# EAGLE design Fruiting_Chamber (EAGLE 9.5.2)

## Sheet 1 of 4: Power
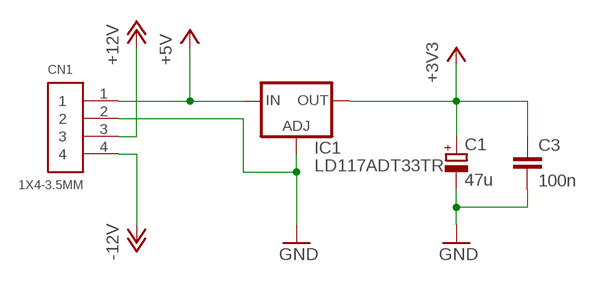
[diagram p0: schematic, sheet 1]

### Parts
C1  47u  CPOL-EUE2.5-6  [E2,5-6]
C3  100n  C-EUC0603  [C0603]
CN1  1X4-3.5MM  [1X04-3.5MM]
IC1  LD117ADT33TR  [DPACK]

### Nets
+3V3: C1.+ C3.1 IC1.4(OUT) ; also sheet 2,3
+5V: CN1.1 IC1.3(IN) ; also sheet 2,3,4
+12V: CN1.3 ; also sheet 2
-12V: CN1.4 ; also sheet 2
GND: C1.- C3.2 CN1.2 IC1.1(ADJ) ; also sheet 2,3,4

## Sheet 2 of 4: Periferals
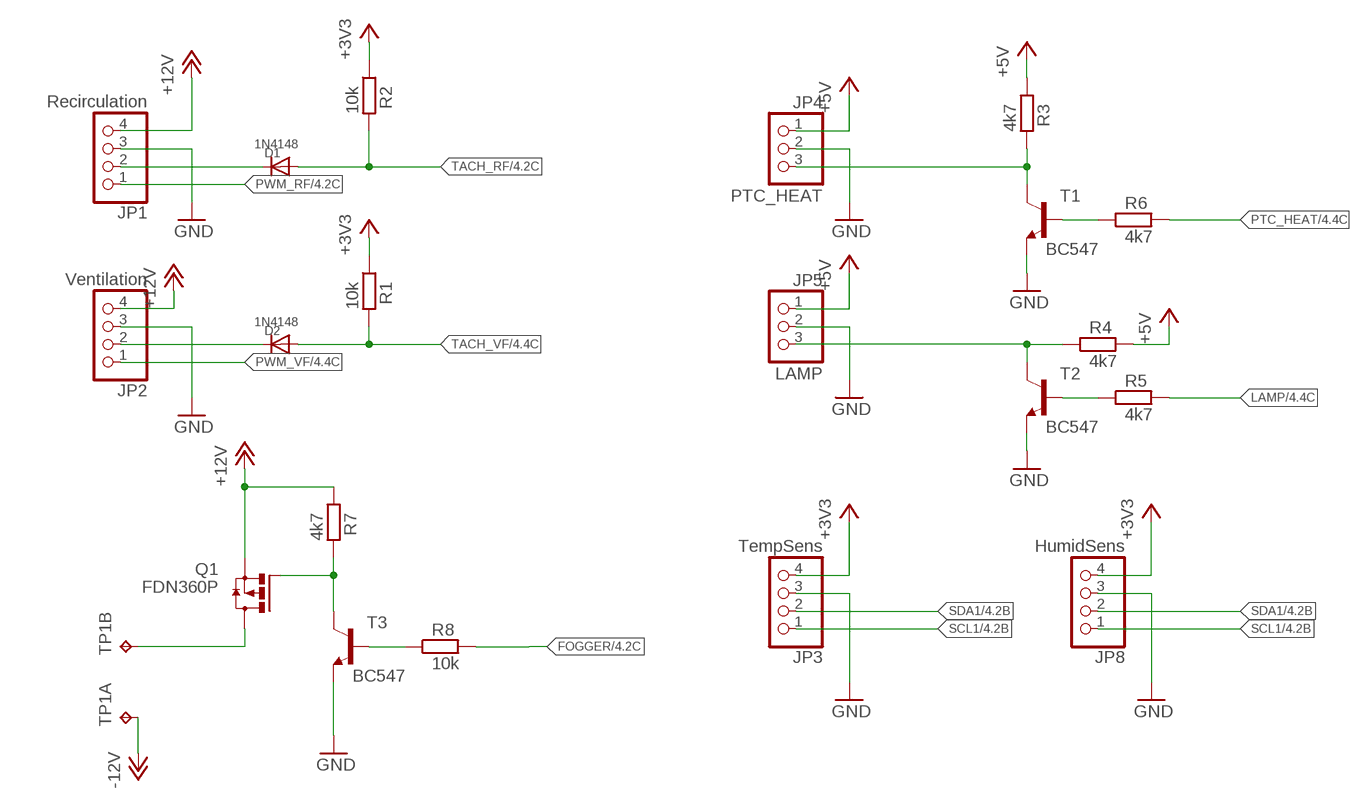
[diagram p1: schematic, sheet 2]

### Parts
D1  1N4148  DIODEDO-1N4148  [DO-1N4148]
D2  1N4148  DIODEDO-1N4148  [DO-1N4148]
JP1  Recirculation  PINHD-1X4/90  [1X04/90]
JP2  Ventilation  PINHD-1X4/90  [1X04/90]
JP3  TempSens  PINHD-1X4/90  [1X04/90]
JP4  PTC_HEAT  PINHD-1X3/90  [1X03/90]
JP5  LAMP  PINHD-1X3/90  [1X03/90]
JP8  HumidSens  PINHD-1X4/90  [1X04/90]
Q1  FDN360P  [SUPER-SOT3]
R1  10k  R-EU_R0805  [R0805]
R2  10k  R-EU_R0805  [R0805]
R3  4k7  R-EU_R0805  [R0805]
R4  4k7  R-EU_R0805  [R0805]
R5  4k7  R-EU_R0805  [R0805]
R6  4k7  R-EU_R0805  [R0805]
R7  4k7  R-EU_R0805  [R0805]
R8  10k  R-EU_R0805  [R0805]
T1  BC547  [TO92]
T2  BC547  [TO92]
T3  BC547  [TO92]
TP1  TP2P2-38-20  [P2-38-20]

### Nets
+3V3: JP3.4 JP8.4 R1.1 R2.1 ; also sheet 1,3
+5V: JP4.1 JP5.1 R3.1 R4.2 ; also sheet 1,3,4
+12V: JP1.4 JP2.4 Q1.2(S) R7.1 ; also sheet 1
-12V: TP1.TP-1 ; also sheet 1
FOGGER: R8.2 ; also sheet 4
GND: JP1.3 JP2.3 JP3.3 JP4.2 JP5.2 JP8.3 T1.1(E) T2.1(E) T3.1(E) ; also sheet 1,3,4
LAMP: R5.2 ; also sheet 4
N$1: D1.C JP1.2
N$2: JP5.3 R4.1 T2.3(C)
N$3: D2.C JP2.2
N$4: JP4.3 R3.2 T1.3(C)
N$5: R6.1 T1.2(B)
N$6: R5.1 T2.2(B)
N$7: Q1.3(D) TP1.TP-2
N$9: Q1.1(G) R7.2 T3.3(C)
N$10: R8.1 T3.2(B)
PTC_HEAT: R6.2 ; also sheet 4
PWM_RF: JP1.1 ; also sheet 4
PWM_VF: JP2.1 ; also sheet 4
SCL1: JP3.1 JP8.1 ; also sheet 4
SDA1: JP3.2 JP8.2 ; also sheet 4
TACH_RF: D1.A R2.2 ; also sheet 4
TACH_VF: D2.A R1.2 ; also sheet 4

## Sheet 3 of 4: User interface connections
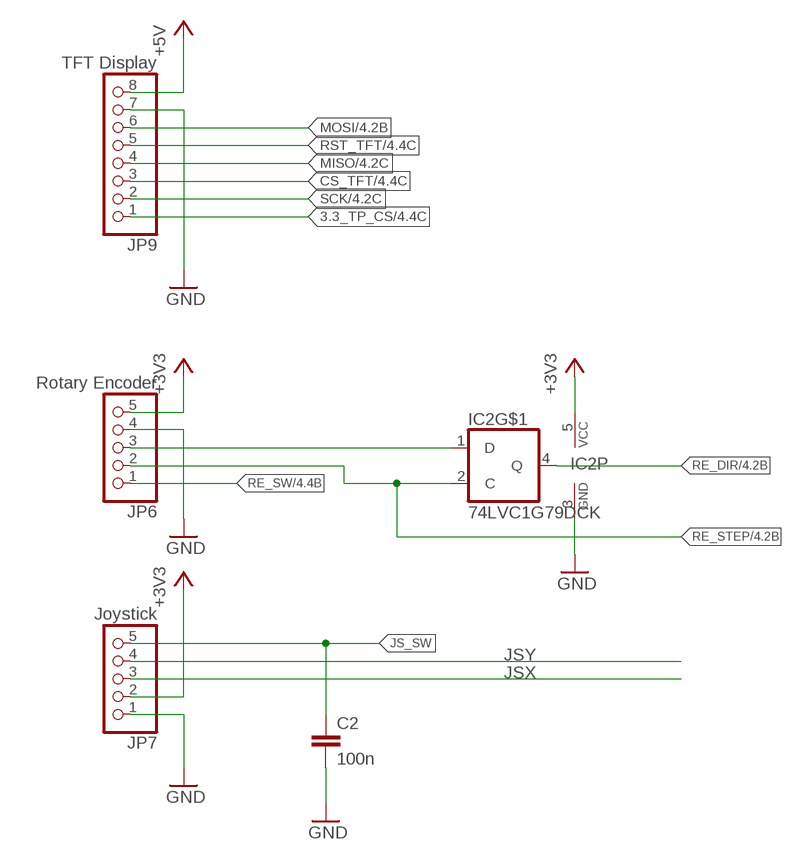
[diagram p2: schematic, sheet 3]

### Parts
C2  100n  C-EUC0603  [C0603]
IC2  74LVC1G79DCK  [SC70-5]
JP6  Rotary Encoder  PINHD-1X5/90  [1X05/90]
JP7  Joystick  PINHD-1X5/90  [1X05/90]
JP9  TFT Display  PINHD-1X8/90  [1X08/90]

### Nets
3.3_TP_CS: JP9.1 ; also sheet 4
+3V3: IC2.5(VCC) JP6.5 JP7.2 ; also sheet 1,2
+5V: JP9.8 ; also sheet 1,2,4
CS_TFT: JP9.3 ; also sheet 4
GND: C2.2 IC2.3(GND) JP6.4 JP7.1 JP9.7 ; also sheet 1,2,4
JS_SW: C2.1 JP7.5
JSX: JP7.3
JSY: JP7.4
MISO: JP9.4 ; also sheet 4
MOSI: JP9.6 ; also sheet 4
N$8: IC2.1(D) JP6.3
RE_DIR: IC2.4(Q) ; also sheet 4
RE_STEP: IC2.2(C) JP6.2 ; also sheet 4
RE_SW: JP6.1 ; also sheet 4
RST_TFT: JP9.5 ; also sheet 4
SCK: JP9.2 ; also sheet 4

## Sheet 4 of 4: Connect to Raspberry Pi
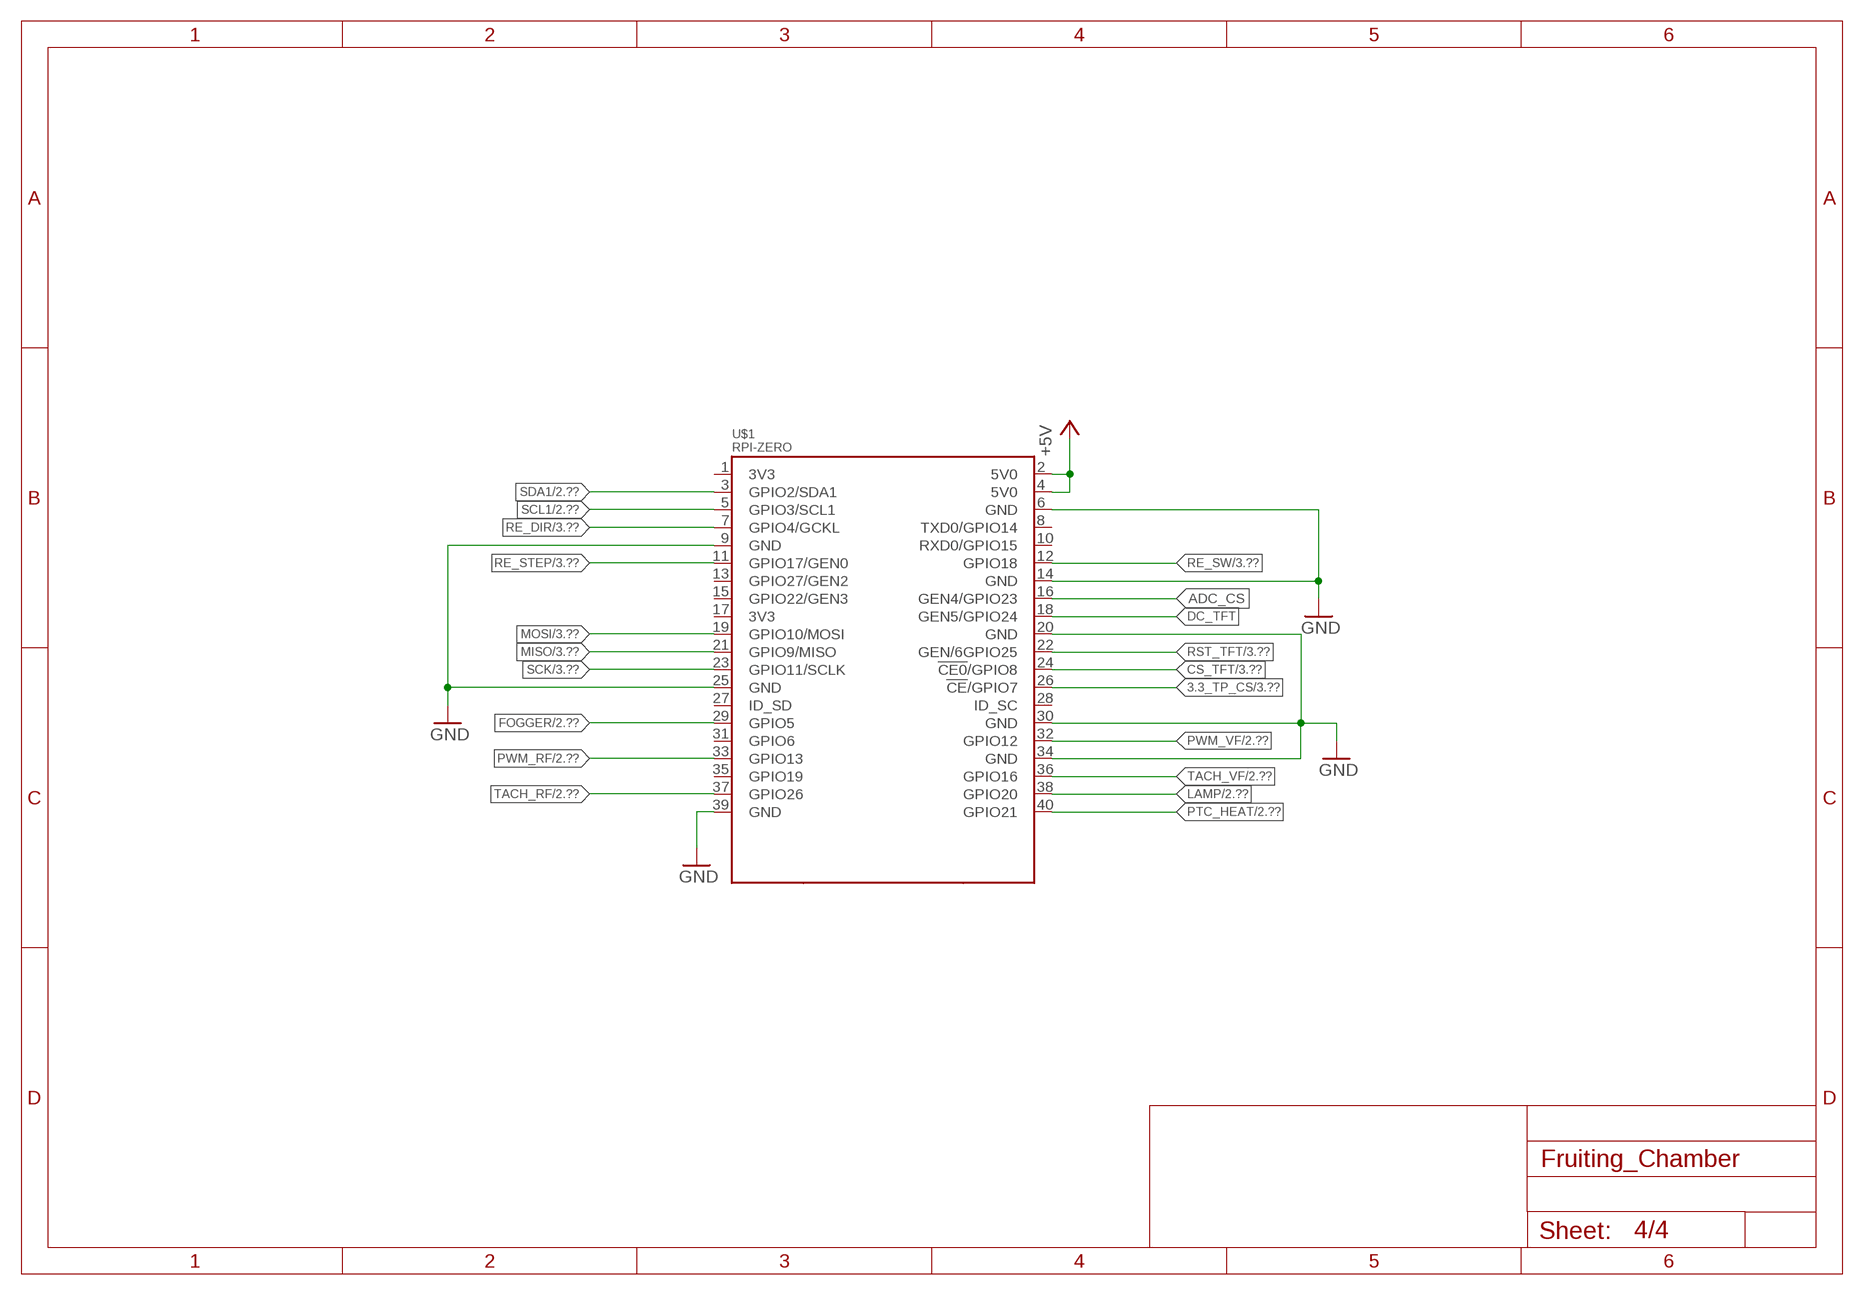
[diagram p3: schematic, sheet 4]

### Parts
U$1  RPI-ZERO  [RASPBERRYPI_BASTELSTUBE_V13_RASPI_BOARD_B+_FULL]

### Nets
3.3_TP_CS: U$1.26(!CE!/GPIO7) ; also sheet 3
+5V: U$1.2(5V0) U$1.4(5V0) ; also sheet 1,2,3
ADC_CS: U$1.16(GEN4/GPIO23)
CS_TFT: U$1.24(!CE0!/GPIO8) ; also sheet 3
DC_TFT: U$1.18(GEN5/GPIO24)
FOGGER: U$1.29(GPIO5) ; also sheet 2
GND: U$1.6(GND) U$1.9(GND) U$1.14(GND) U$1.20(GND) U$1.25(GND) U$1.30(GND) U$1.34(GND) U$1.39(GND) ; also sheet 1,2,3
LAMP: U$1.38(GPIO20) ; also sheet 2
MISO: U$1.21(GPIO9/MISO) ; also sheet 3
MOSI: U$1.19(GPIO10/MOSI) ; also sheet 3
PTC_HEAT: U$1.40(GPIO21) ; also sheet 2
PWM_RF: U$1.33(GPIO13) ; also sheet 2
PWM_VF: U$1.32(GPIO12) ; also sheet 2
RE_DIR: U$1.7(GPIO4/GCKL) ; also sheet 3
RE_STEP: U$1.11(GPIO17/GEN0) ; also sheet 3
RE_SW: U$1.12(GPIO18) ; also sheet 3
RST_TFT: U$1.22(GEN/6GPIO25) ; also sheet 3
SCK: U$1.23(GPIO11/SCLK) ; also sheet 3
SCL1: U$1.5(GPIO3/SCL1) ; also sheet 2
SDA1: U$1.3(GPIO2/SDA1) ; also sheet 2
TACH_RF: U$1.37(GPIO26) ; also sheet 2
TACH_VF: U$1.36(GPIO16) ; also sheet 2
Unconnected: U$1.1(3V3) U$1.8(TXD0/GPIO14) U$1.10(RXD0/GPIO15) U$1.13(GPIO27/GEN2) U$1.15(GPIO22/GEN3) U$1.17(3V3) U$1.27(ID_SD) U$1.28(ID_SC) U$1.31(GPIO6) U$1.35(GPIO19)

## Library data of the parts
C1 = rcl:CPOL-EU: POLARIZED CAPACITOR, European symbol; SPICEPREFIX: C
C2 C3 = rcl:C-EU: CAPACITOR, European symbol; SPICEPREFIX: C
CN1 = adafruit:1X4: 4-pin connector
D1 D2 = adafruit:DIODE: Diode SMADIODE - SMA Surface Mount Package 20V 1A Schottky Diode Digikey: 641-1014-6-ND DO-1N4148 - Through Hole Small Current Diode SOD-123 20V 1 A (.5mV Vf) Schottky Diode - Digikey: MBRX120TPMSCT-ND SOD-323 10V 570mA (.38mV Vf, 3ns) Schottky Diode - Digikey: ZLLS410CT-ND SOD-523 30V 30mA Schottky Diode (RB751S-40TE61) - Digikey: RB751S-40TE61CT-ND SOT23-R/W - SOT23 Package (R = Solder Paste/Reflow Ovens, W = Hand-Soldering) BAT54Film 40V 300mA - Digikey: 497-7162-1-ND
IC1 = v-reg:LD117A?*: Low drop fixed and adjustable positive voltage regulators 1 A Source: http://www.st.com/stonline/products/literature/ds/7194/ld1117axx.pdf
IC2 = 74xx-little-de:74*1G79: Single Positive-Edge-Triggered D-Type Flip-Flop Source: Data sheet <http://www.ti.com/lit/ds/symlink/sn74lvc1g79.pdf>
JP1-JP3 JP8 = pinhead:PINHD-1X4: PIN HEADER
JP4 JP5 = pinhead:PINHD-1X3: PIN HEADER
JP6 JP7 = pinhead:PINHD-1X5: PIN HEADER
JP9 = pinhead:PINHD-1X8: PIN HEADER
Q1 = transistor-power:FDN360P: Single P-Channel, PowerTrench (R) MOSFET Source: http://www.fairchildsemi.com/ds/FD/FDN360P.pdf
R1-R8 = rcl:R-EU_: RESISTOR, European symbol; SPICEPREFIX: R
T1-T3 = transistor:BC547: NPN TRANSISTOR
TP1 = testpad:TP2: Test pad
U$1 = RPI-Zero:RPI-ZERO

## Net classes
0 GND: clearance 0.508 mm

## Board
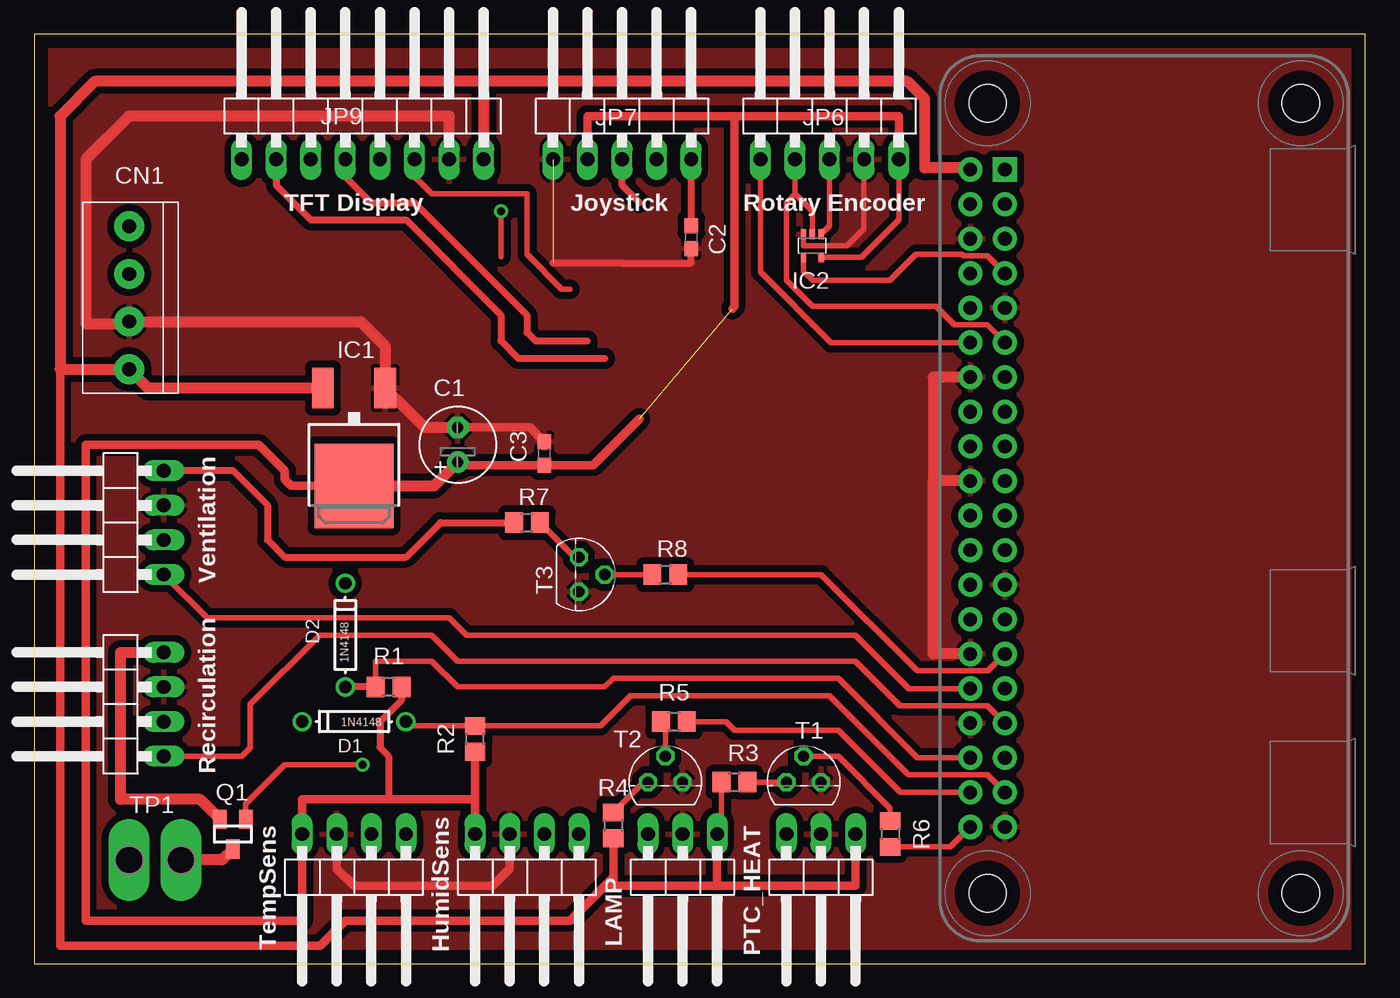
[diagram p4: board, top side]
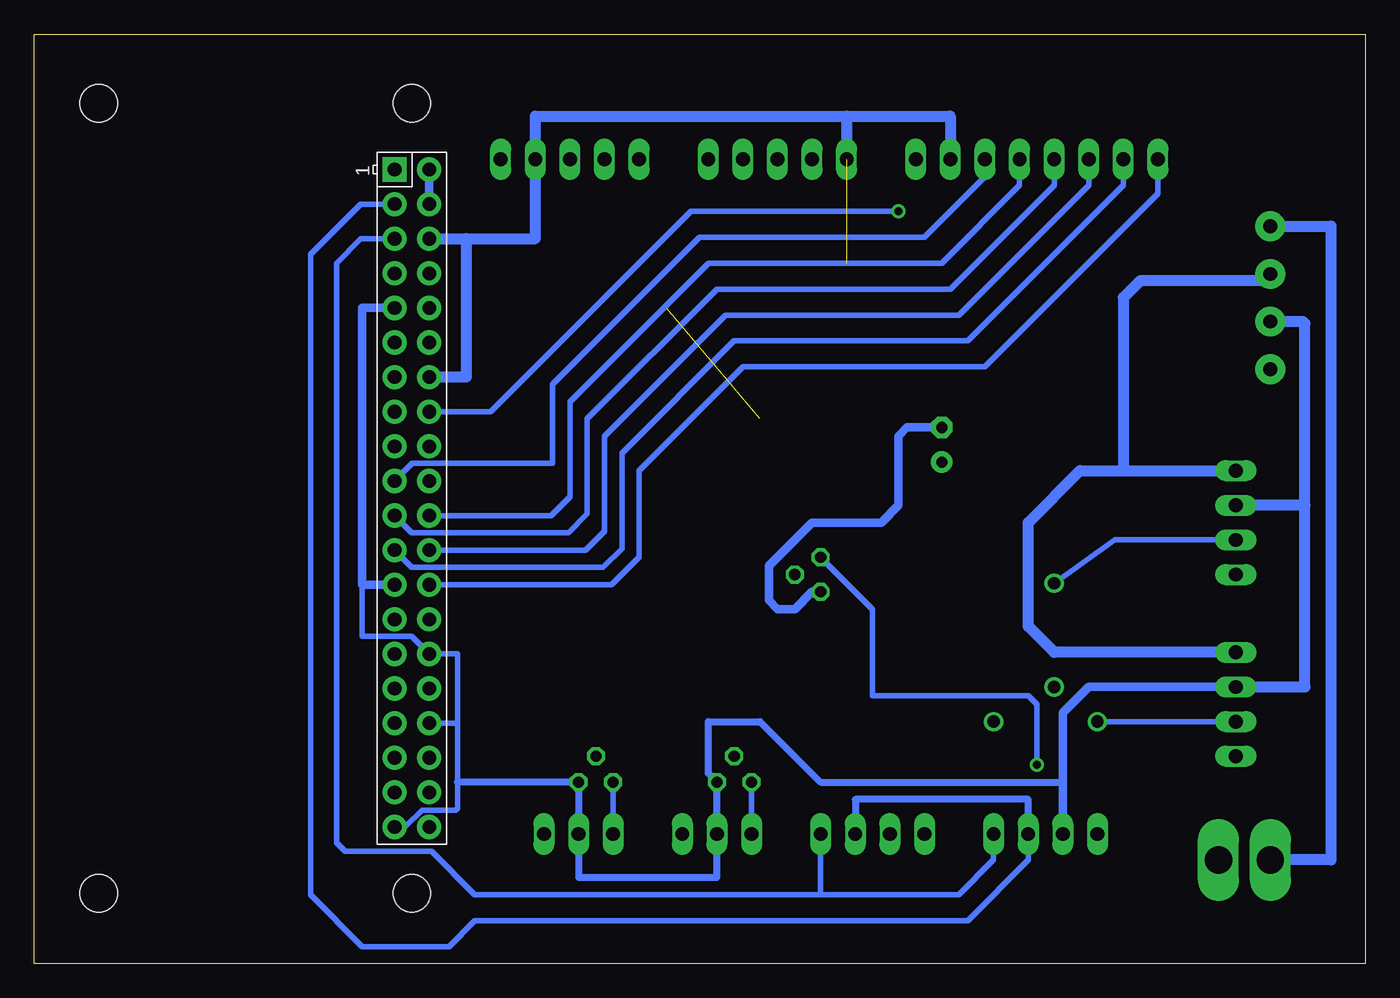
[diagram p5: board, bottom side, seen from below]

Size 97.77 x 68.25 mm. Coordinates in mm from the lower left corner, seen from the top.
Outline: 0,0 97.77,0 97.77,68.25 0,68.25 0,0
Copper layers (1*16): Top 0.035mm / dielectric 1.5mm / Bottom 0.035mm
Design rules "default": minimum track width 6mil, minimum drill 0.35mm, track to track 6mil, track to pad 6mil, pad to pad 6mil, via to via 6mil, smd to smd 6mil, copper to edge 40mil, drill to drill 6mil, minimum pad ring 10mil, minimum via ring 8mil, stop-mask expansion 4mil, vias tented up to drill 0mil, thermal gap 10mil

### Footprints (pad centres in the part's own frame; a part is rotated, then mirrored left to right if it is on the bottom)
E2,5-6 = drill 0.813 pad 1.6: + -1.27,0 | drill 0.813 pad 1.6 octagon: - 1.27,0
C0603 = smd 1.1 x 1: 1 -0.85,0; 2 0.85,0
1X04-3.5MM = drill 1 pad 2.184: 1 -5.25,0; 2 -1.75,0; 3 1.75,0; 4 5.25,0
DO-1N4148 = drill 0.9: A -3.81,0; C 3.81,0
DPACK = smd 1.6 x 3: 1 -2.28,-4.8; 3 2.28,-4.8 | smd 5.8 x 6.2: 4 0,2.38
SC70-5 = smd 0.4 x 0.7: 1 -0.65,-0.85; 2 0,-0.85; 3 0.65,-0.85; 4 0.65,0.85; 5 -0.65,0.85
1X04/90 = drill 1.016 long: 1 -3.81,-3.81; 2 -1.27,-3.81; 3 1.27,-3.81; 4 3.81,-3.81
1X03/90 = drill 1.016 long: 1 -2.54,-3.81; 2 0,-3.81; 3 2.54,-3.81
1X05/90 = drill 1.016 long: 1 -5.08,-3.81; 2 -2.54,-3.81; 3 0,-3.81; 4 2.54,-3.81; 5 5.08,-3.81
1X08/90 = drill 1.016 long: 1 -8.89,-3.81; 2 -6.35,-3.81; 3 -3.81,-3.81; 4 -1.27,-3.81; 5 1.27,-3.81; 6 3.81,-3.81; 7 6.35,-3.81; 8 8.89,-3.81
SUPER-SOT3 = smd 1 x 1.4: 1 -0.95,-1.1; 2 0.95,-1.1; 3 0,1.1
R0805 = smd 1.3 x 1.5: 1 -0.95,0; 2 0.95,0
TO92 = drill 0.813 octagon: 1 1.27,0; 2 0,1.905; 3 -1.27,0
P2-38-20 = drill 2.007 pad 2.54 long: TP-1 -1.905,0; TP-2 1.905,0
RASPBERRYPI_BASTELSTUBE_V13_RASPI_BOARD_B+_FULL = drill 1 pad 1.778 square: 1 8.37,25.23 | drill 1 pad 1.778: 2 8.37,27.77; 3 10.91,25.23; 4 10.91,27.77; 5 13.45,25.23; 6 13.45,27.77; 7 15.99,25.23; 8 15.99,27.77; 9 18.53,25.23; 10 18.53,27.77; 11 21.07,25.23; 12 21.07,27.77; 13 23.61,25.23; 14 23.61,27.77; 15 26.15,25.23; 16 26.15,27.77; 17 28.69,25.23; 18 28.69,27.77; 19 31.23,25.23; 20 31.23,27.77; 21 33.77,25.23; 22 33.77,27.77; 23 36.31,25.23; 24 36.31,27.77; 25 38.85,25.23; 26 38.85,27.77; 27 41.39,25.23; 28 41.39,27.77; 29 43.93,25.23; 30 43.93,27.77; 31 46.47,25.23; 32 46.47,27.77; 33 49.01,25.23; 34 49.01,27.77; 35 51.55,25.23; 36 51.55,27.77; 37 54.09,25.23; 38 54.09,27.77; 39 56.63,25.23; 40 56.63,27.77 | hole 2.75: 3.5,3.5; 3.5,26.5; 61.5,3.5; 61.5,26.5

### Placement (x,y rotation side)
C1  31.11,38.1 90 top
C2  48.26,53.34 270 top
C3  37.47,37.47 90 top
CN1  6.99,48.9 90 top
D1  23.5,17.78 180 top
D2  22.86,24.13 90 top
IC1  23.5,37.47 180 top
IC2  57.15,52.7 180 top
JP1  5.71,19.05 90 top
JP2  5.71,32.38 90 top
JP3  23.5,5.71 180 top
JP4  57.78,5.71 180 top
JP5  47.62,5.71 180 top
JP6  58.42,62.87 0 top
JP7  43.18,62.87 0 top
JP8  36.2,5.71 180 top
JP9  24.13,62.87 0 top
Q1  14.61,9.53 180 top
R1  26.04,20.32 180 top
R2  32.38,16.51 90 top
R3  51.44,13.34 0 top
R4  42.55,10.16 270 top
R5  46.99,17.78 0 top
R6  62.87,9.53 270 top
R7  36.2,32.38 0 top
R8  46.35,28.57 0 top
T1  56.52,13.34 0 top
T2  46.35,13.34 0 top
T3  40.01,28.57 270 top
TP1  8.89,7.62 0 top
U$1  96.52,66.67 270 bottom

### Tracks (layer width: path | path; a pad name or v marks a point on that pad's centre or on a via)
3.3_TP_CS
  Bottom 0.406: JP9.1 15.24,56.52 27.94,43.81 45.72,43.81 53.34,36.2 53.34,29.84 55.36,27.82 U$1.26
+3V3  (1 unrouted)
  Top 0.406: IC2.5 60.74,51.85 63.5,54.61 JP6.5
  Top 0.508: R1.1 26.98,19.36 25.4,17.78 25.4,15.88 26.04,15.24 26.04,12.06
  Top 0.61: IC1.4 18.89,35.09 18.41,35.56 18.41,36.2 16.51,38.1 3.81,38.1 3.81,3.17 19.68,3.17 JP3.4 19.68,12.06 26.04,12.06 32.38,12.06 | 32.38,12.06 JP8.4 | R2.1 32.38,12.06 | C1.+ 31.33,36.62 C3.1 41.06,36.62 44.45,40.01 | JP7.2 40.64,62.23 51.44,62.23 | 51.44,62.23 63.5,62.23 JP6.5 | 51.44,62.23 51.44,48.26 51.27,48.1
  Top 0.813: IC1.4 29.37,35.09 C1.+
+5V
  Top 0.406: R3.1 50.48,9.85 JP5.1
  Top 0.61: JP4.1 60.33,5.71 50.16,5.71 | 50.16,5.71 JP5.1 | R4.2 42.55,6.35 | 42.55,6.35 42.55,5.71 50.16,5.71 | 42.55,6.35 39.37,3.17 22.86,3.17 21.01,1.32 1.91,1.32 1.91,43.65
  Top 0.813: IC1.3 8.37,42.27 CN1.1 1.91,43.65 1.91,62.23 4.45,64.77 33.02,64.77 | U$1.2 68.64,58.42 65.41,58.42 65.41,63.5 64.14,64.77 33.02,64.77 | 33.02,64.77 JP9.8
  Bottom 0.61: U$1.2 U$1.4
+12V
  Top 0.508: R7.1 29.84,32.38 27.3,29.84 18.41,29.84 17.14,31.11 17.14,33.66 14.61,36.2 JP2.4
  Top 0.813: Q1.2 12.21,12.06 6.35,12.06 6.35,22.86 JP1.4
  Bottom 0.813: JP1.4 22.86,22.86 24.77,24.77 24.77,32.38 20.95,36.2 17.78,36.2 | 17.78,36.2 JP2.4 | CN1.3 7.46,50.16 16.51,50.16 17.78,48.9 17.78,36.2
-12V
  Bottom 0.813: CN1.4 2.54,54.15 2.54,7.62 TP1.TP-1
ADC_CS  (via drill 0.6)
  Top 0.406: 34.29,51.91 v34.29,55.24
  Bottom 0.406: v34.29,55.24 49.53,55.24 64.25,40.52 U$1.16
CS_TFT
  Bottom 0.406: JP9.3 20.32,57.15 29.84,47.62 46.99,47.62 55.88,38.73 55.88,31.75 57.27,30.36 U$1.24
FOGGER
  Top 0.406: R8.2 57.78,28.57 64.86,21.5 70.05,21.5 U$1.29
GND  (1 unrouted)
  Top 0.406: JP6.4 60.96,53.98 59.69,52.7 56.5,52.7 IC2.3
  Top 0.508: 38.1,51.44 43.18,51.44 48.26,51.44 C2.2
  Top 0.61: JP8.3 34.92,6.99 33.66,5.71 23.5,5.71 22.23,6.99 JP3.3 | C3.2 36.41,39.37 C1.-
  Top 0.813: C1.- 28.67,39.37 IC1.1 25.77,45.34 23.98,47.15 CN1.2 6.83,46.99 3.81,46.99 3.81,59.05 6.99,62.23 30.48,62.23 JP9.7 | U$1.14 66.04,43.06 66.04,35.45 | U$1.20 66.04,35.45 | U$1.30 66.04,22.75 66.04,35.45
  Bottom 0.406: U$1.39 70.51,10.04 69.27,11.29 66.81,11.29 66.67,11.43 66.67,13.34 66.67,17.66 | U$1.34 66.67,17.66 | 66.67,17.66 66.67,22.75 U$1.30 70.05,24.04 73.66,24.04 73.66,27.82
  Bottom 0.508: 66.67,13.34 T1.1 JP4.2 57.78,6.35 47.62,6.35 JP5.2 T2.1 48.26,13.97 48.26,17.78 44.45,17.78 40.01,13.34 22.23,13.34
  Bottom 0.61: JP3.3 22.23,13.34 22.23,18.41 20.32,20.32 JP1.3 | T3.1 40.64,27.3 41.91,26.04 43.18,26.04 43.81,26.67 43.81,29.21 40.64,32.38 35.56,32.38 34.29,33.66 34.29,38.73 33.66,39.37 C1.- | U$1.9 73.66,48.15 73.66,27.82 U$1.25
  Bottom 0.813: JP1.3 4.45,20.32 4.45,33.66 | 4.45,33.66 JP2.3 | 4.45,33.66 4.45,46.99 4.6,47.15 CN1.2 | U$1.6 66.04,53.23 | U$1.14 66.04,43.06 66.04,53.23 | 66.04,53.23 60.96,53.23 JP6.4 60.96,62.23 38.1,62.23 | 38.1,62.23 JP7.1 | 38.1,62.23 30.48,62.23 JP9.7
  pour Top: 0,68.58 98.42,68.58 98.42,-0.64 0,-0.64
JS_SW
  Top 0.508: JP7.5 C2.1
JSX
  Top 0.508: 44.45,55.88 43.18,57.15 JP7.3
LAMP
  Top 0.406: U$1.38 63.62,12.59 59.05,17.14 51.44,17.14 50.8,17.78 R5.2
MISO
  Top 0.508: JP9.4 22.86,57.78 24.77,55.88 27.94,55.88 36.2,47.62 36.2,46.35 36.83,45.72 40.64,45.72
  Bottom 0.406: JP9.4 22.86,57.15 30.48,49.53 47.62,49.53 57.15,40.01 57.15,33.02 58.51,31.66 70.05,31.66 U$1.21
MOSI
  Top 0.406: 39.37,49.53 38.73,49.53 36.2,52.07 36.2,56.52 29.21,56.52 27.94,57.78 JP9.6
  Bottom 0.406: JP9.6 27.94,57.78 32.38,53.34 48.9,53.34 59.69,42.55 59.69,36.74 70,36.74 U$1.19
N$1
  Bottom 0.406: D1.C JP1.2
N$2
  Top 0.406: R4.1 44.77,13.34 T2.3
  Bottom 0.406: JP5.3 T2.3
N$3
  Bottom 0.406: JP2.2 18.41,31.11 D2.C
N$4
  Top 0.406: R3.2 T1.3
  Bottom 0.406: T1.3 JP4.3
N$5
  Top 0.406: R6.1 62.87,11.43 59.05,15.24 T1.2
N$6
  Top 0.406: R5.1 46.35,17.46 T2.2
N$7
  Top 0.813: Q1.3 13.8,7.62 TP1.TP-2
N$8
  Top 0.406: IC2.1 58.42,54.17 JP6.3
N$9  (via drill 0.6)
  Top 0.406: T3.3 39.69,29.84 R7.2 | v24.13,14.61 18.41,14.61 15.55,11.74 Q1.1
  Bottom 0.406: T3.3 36.2,26.04 36.2,19.68 24.77,19.68 24.13,19.05 v24.13,14.61
N$10
  Top 0.406: T3.2 R8.1
PTC_HEAT
  Top 0.406: R6.2 67.28,8.57 U$1.40
PWM_RF
  Top 0.406: JP1.1 15.24,15.24 15.88,15.88 15.88,19.05 20.95,24.13 29.21,24.13 31.11,22.23 60.33,22.23 63.59,18.96 70,18.96 U$1.33
PWM_VF
  Top 0.406: U$1.32 64.25,20.2 60.33,24.13 31.75,24.13 30.48,25.4 12.7,25.4 JP2.1
RE_DIR
  Top 0.406: IC2.4 56.5,50.81 57.15,50.16 62.87,50.16 64.77,52.07 68.14,52.07 68.23,51.98 70,51.98 U$1.7
RE_STEP
  Top 0.406: IC2.2 57.15,55.24 55.88,56.52 | 55.88,56.52 JP6.2 | 55.88,56.52 55.24,55.88 55.24,50.16 57.15,48.26 66.24,48.26 67.6,46.9 70,46.9 U$1.11
RE_SW
  Top 0.406: JP6.1 53.34,50.8 58.53,45.6 U$1.12
RST_TFT
  Bottom 0.406: JP9.5 25.4,57.15 31.11,51.44 48.26,51.44 58.42,41.27 58.42,34.29 59.8,32.91 U$1.22
SCK
  Top 0.508: JP9.2 17.78,57.15 20.32,54.61 27.3,54.61 34.29,47.62 34.29,45.72 35.56,44.45 41.91,44.45
  Bottom 0.406: JP9.2 17.78,57.15 29.21,45.72 46.35,45.72 54.61,37.47 54.61,30.48 55.97,29.12 70.05,29.12 U$1.23
SCL1
  Bottom 0.406: JP3.1 27.3,7.62 29.84,5.08 40.01,5.08 | 40.01,5.08 JP8.1 | 40.01,5.08 65.41,5.08 68.58,8.26 74.93,8.26 75.56,8.89 75.56,51.44 73.78,53.23 U$1.5
SDA1
  Bottom 0.406: JP3.2 24.77,7.62 29.21,3.17 65.41,3.17 67.31,1.27 73.66,1.27 77.47,5.08 77.47,52.07 73.78,55.77 U$1.3
  Bottom 0.508: JP3.2 24.77,12.06 37.47,12.06 JP8.2
TACH_RF
  Top 0.406: U$1.37 70,13.88 64.22,13.88 58.42,19.68 43.81,19.68 41.59,17.46 R2.2 27.62,17.46 D1.A
TACH_VF
  Top 0.406: R1.2 25.09,22.23 29.21,22.23 31.11,20.32 41.91,20.32 42.55,20.95 59.05,20.95 64.89,15.12 U$1.36
  Top 0.508: R1.2 D2.A